# Altium schematic sheet Sheet1.SchDoc
size B; Organization: Altium Limited; Address1: L3, 12a Rodborough Rd; Address2: Frenchs Forest; Address3: NSW; Address4: Australia 2086
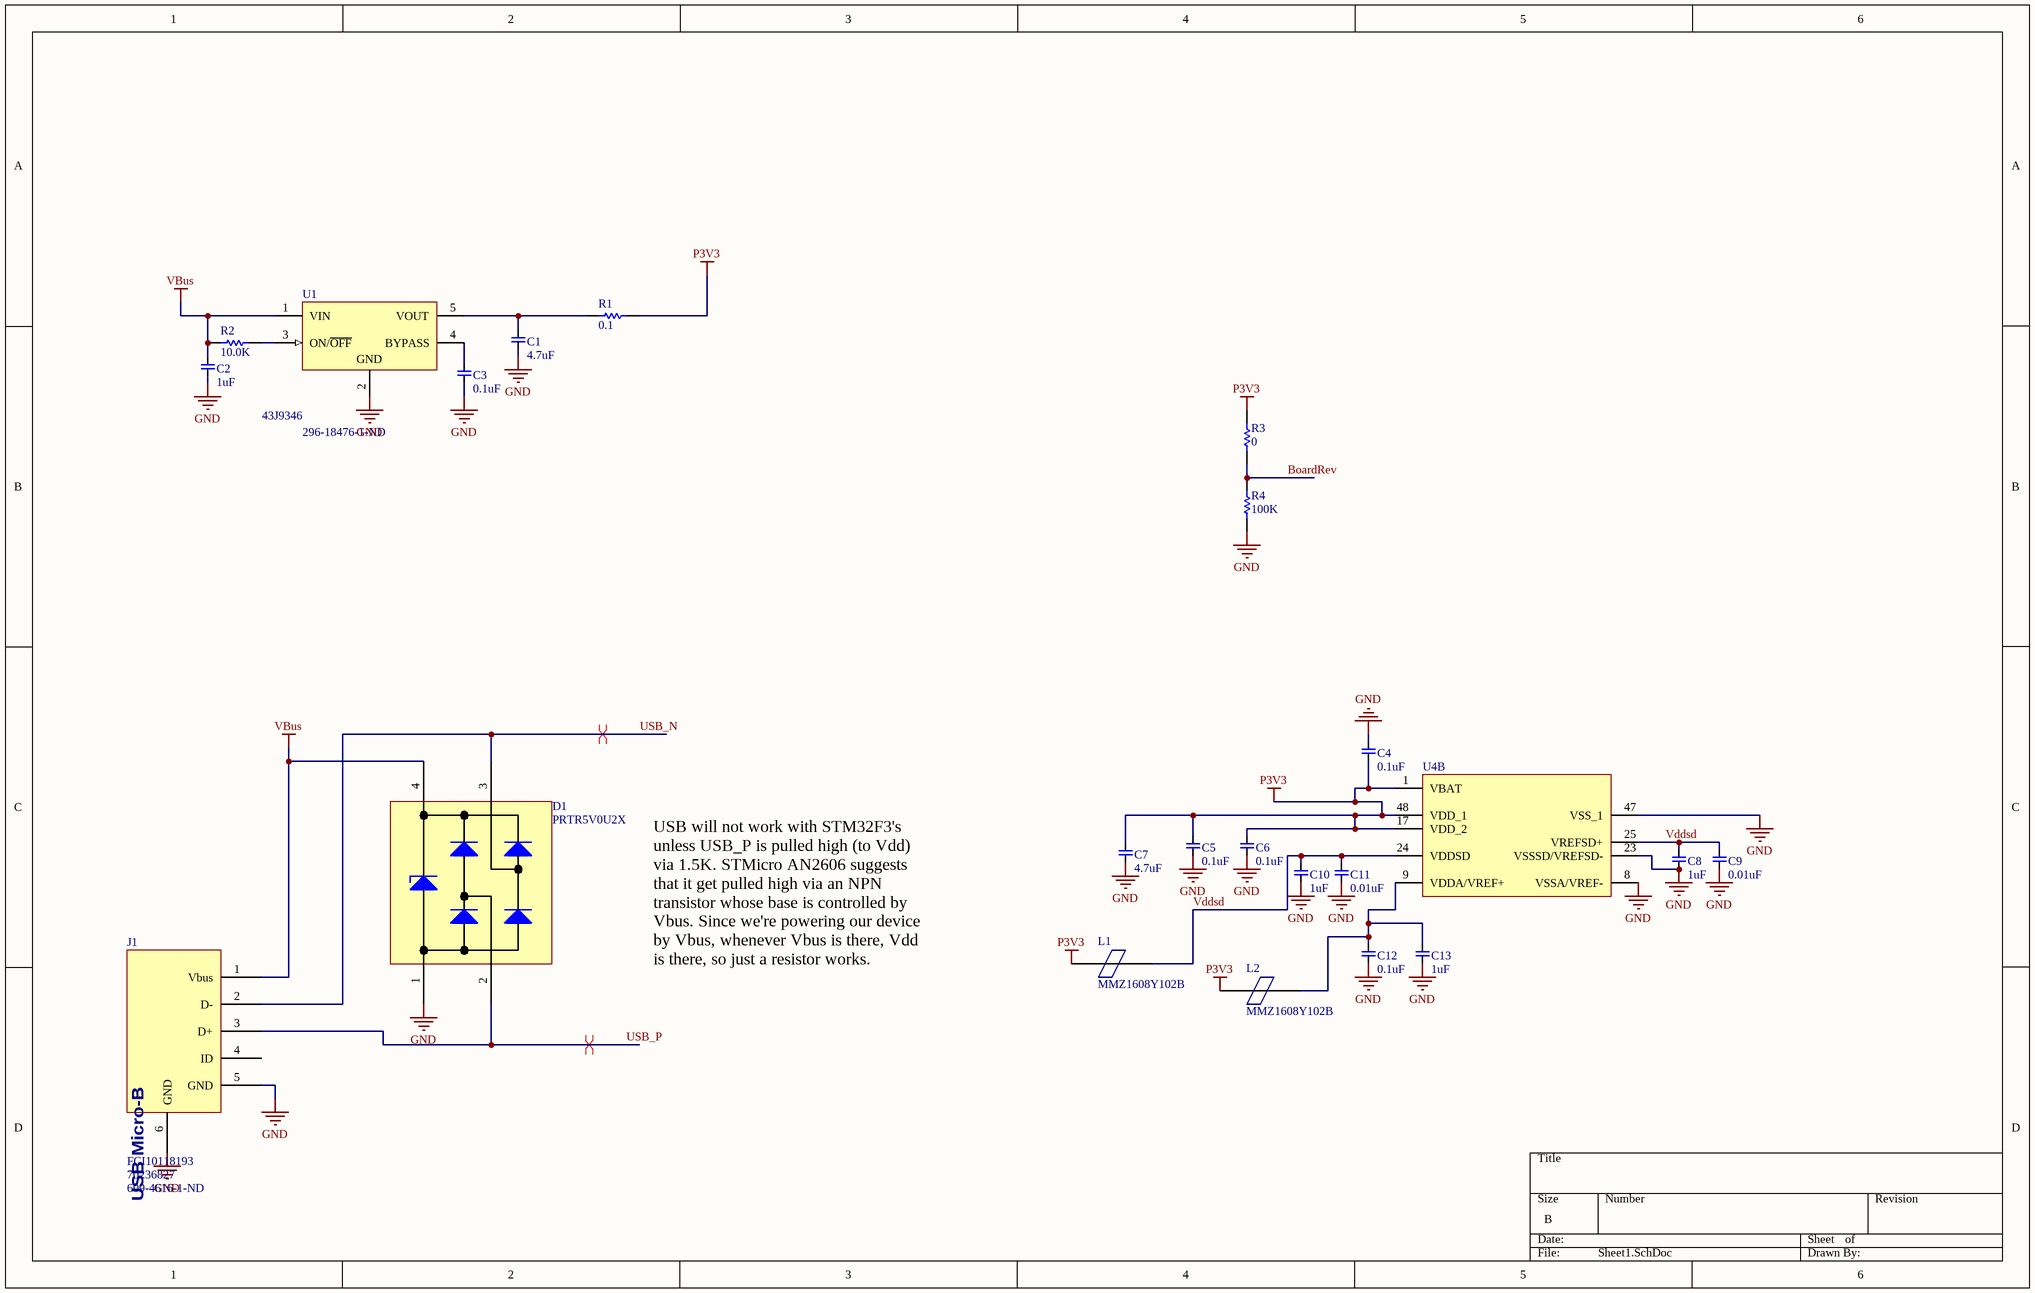
[diagram p0: Sheet1.SchDoc]

## Parts
C1  4.7uF  [CAP0603]
C2  1uF  [CAP0402]
C3  0.1uF  [CAP0402]
C4  0.1uF  [CAP0402]
C5  0.1uF  [CAP0402]
C6  0.1uF  [CAP0402]
C7  4.7uF  [CAP0603]
C8  1uF  [CAP0603]
C9  0.01uF  [CAP0402]
C10  1uF  [CAP0603]
C11  0.01uF  [CAP0402]
C12  0.1uF  [CAP0402]
C13  1uF  [CAP0603]
D1  PRTR5V0U2X  [SOT190P230X110-4N]
J1  FCI10118193  Supplier Part Number 1: 70236827  Supplier Part Number 2: 609-4616-1-ND  [FCI_10118193]
L1  MMZ1608Y102B  [INDC1608X06N]
L2  MMZ1608Y102B  [INDC1608X06N]
R1  0.1  [RES0402]
R2  10.0K  [RES0402]
R3  0  [RES0402]
R4  100K  [RES0402]
U1  Supplier Part Number 1: 43J9346  Supplier Part Number 2: 296-18476-1-ND  [TI-DBV5_N]
U4  (no value)  [STM-LQFP48_N]  (part B of 2)

## Nets
GND: C1.1 C2.1 C3.1 C4.2 C5.1 C6.1 C7.1 C8.1 C9.1 C10.1 C11.1 C12.1 C13.1 D1.1 J1.5(GND) J1.6(GND) R4.1 U1.2(GND) U4.8(VSSA/VREF-) U4.23(VSSSD/VREFSD-) U4.47(VSS_1)
P3V3: C4.1 C5.2 C6.2 C7.2 L1.1 L2.1 R1.2 R3.2 U4.1(VBAT) U4.17(VDD_2) U4.48(VDD_1)
VBus: C2.2 D1.4 J1.1(Vbus) R2.1 U1.1(VIN)
BoardRev: R3.1 R4.2
USB_N: D1.3 J1.2(D-)
USB_P: D1.2 J1.3(D+)
Vddsd: C8.2 C9.2 C10.2 C11.2 L1.2 U4.24(VDDSD) U4.25(VREFSD+)
NetC1_2: C1.2 R1.1 U1.5(VOUT)
NetC3_2: C3.2 U1.4(BYPASS)
NetC12_2: C12.2 C13.2 L2.2 U4.9(VDDA/VREF+)
NetR2_2: R2.2 U1.3(ON/~{OFF})

Not connected (* = marked no-connect by the designer): J1 4(ID)

## Layout directives
differential pair: USB_N, USB_P

## Notes on the sheet
- USB will not work with STM32F3's unless USB_P is pulled high (to Vdd) via 1.5K. STMicro AN2606 suggests that it get pulled high via an NPN transistor whose base is controlled by Vbus. Since we're powering our device by Vbus, whenever Vbus is there, Vdd is there, so just a resistor works.
- Title
- Size:
- Date:
- File:
- C
- Number:
- Time:
- Revision:
- Sheet
- of
- (in symbol CONN_USB_MICRO-B_HORIZ_TH) USB Micro-B

## Library data of the parts
C1 C7 = 878: CAP 4.7uF +/-10% 10V X6S 0603; Manufacturer: TDK; Manufacturer PN: C1608X6S1A475K; ID: 878; PkgCode: 0603; Value: 4.7uF; Tolerance: +/-10%; Voltage: 10V; Dielectric: X6S; ComponentLink1Description: Datasheet; ComponentLink1URL: http://www.tdk.com/pdf/general_B11.pdf; MaxComponentHeight: 0.9mm
C2 = 596: CAP 1uF +/-10% 10V X5R 0402; Manufacturer: TDK; Manufacturer PN: C1005X5R1A105K; ID: 596; PkgCode: 0402; Value: 1uF; Tolerance: +/-10%; Voltage: 10V; Dielectric: X5R; ComponentLink1Description: Datasheet; ComponentLink1URL: http://www.tdk.com/pdf/general_B11.pdf; MaxComponentHeight: 0.55mm
C3-C6 C12 = 485: CAP 0.1uF +/-10% 25V X7R 0402; Manufacturer: TDK; Manufacturer PN: C1005X7R1E104K; ID: 485; PkgCode: 0402; Value: 0.1uF; Tolerance: +/-10%; Voltage: 25V; Dielectric: X7R; ComponentLink1Description: Datasheet; ComponentLink1URL: http://www.tdk.com/pdf/general_B11.pdf; MaxComponentHeight: 0.55mm
C8 C10 C13 = 820: CAP 1uF +/-10% 25V X7R 0603; Manufacturer: TDK; Manufacturer PN: C1608X7R1E105K; ID: 820; PkgCode: 0603; Value: 1uF; Tolerance: +/-10%; Voltage: 25V; Dielectric: X7R; ComponentLink1Description: Datasheet; ComponentLink1URL: http://www.tdk.com/pdf/general_B11.pdf; MaxComponentHeight: 0.9mm
C9 C11 = 514: CAP 0.01uF +/-20% 50V X6S 0402; Manufacturer: TDK; Manufacturer PN: C1005X6S1H103M; ID: 514; PkgCode: 0402; Value: 0.01uF; Tolerance: +/-20%; Voltage: 50V; Dielectric: X6S; ComponentLink1Description: Datasheet; ComponentLink1URL: http://www.tdk.com/pdf/general_B11.pdf; MaxComponentHeight: 0.55mm
D1 = PRTR5V0U2X: Diode Array, ESD Protection 1pF USB2.0 SOT143; Manufacturer: NXP Semiconductors; ComponentLink1Description: Datasheet; ComponentLink1URL: http://www.nxp.com/documents/data_sheet/PRTR5V0U2X.pdf; Manufacturer PN: PRTR5V0U2X; Supplier 1: Digi-Key; Supplier Part Number 1: 568-4140-1-ND; Supplier 2: Mouser; Supplier Part Number 2: 771-PRTR5V0U2X-T/R; Supplier 3: Newark; Supplier Part Number 3: 75R4845
J1 = CONN_USB_MICRO-B_HORIZ_TH: Connector Receptacle USB - micro B 2.0 5 Position Surface Mount, Right Angle, Horizontal; Manufacturer: FCI; Manufacturer PN: 10118193-0001LF; Supplier 1: Allied; Supplier 2: Digi-Key
L1 L2 = MMZ1608Y102B: Ferrite, 1000oh, 400mA, 0603; ComponentLink1Description: Datasheet; ComponentLink1URL: http://www.tdk.co.jp/tefe02/e9412_mmz.pdf; Supplier 1: Newark; Supplier 2: Digi-Key; Supplier Part Number 1: 33P7606; Supplier Part Number 2: 445-1552-1-ND
R1 = 0402_0.1ohm: RES .1 OHM 1/6W 1% 0402 SMD; Manufacturer: Panasonic; Manufacturer PN: ERJ-2BSFR10X; Value: 0.1; Supplier 1: Arrow; Supplier Part Number 1: 41790361S8773345N1386; Supplier 2: Newark; Supplier Part Number 2: 53W4137; Supplier 3: Allied; Supplier Part Number 3: 70260854; Supplier 4: Digi-Key; Supplier Part Number 4: P.10AKCT-ND
R2 = 963: Resistor SMT 0402 10.0K 1% ohm; Manufacturer: Vishay; Manufacturer PN: CRCW040210K0FKED; ID: 963; Tempco: 100ppm/C; Power: 1/16W; PkgCode: 0402; Value: 10.0K; Tolerance: 1%; Supplier 1: Digi-Key; Supplier Part Number 1: 541-10.0KLCT-ND; ComponentLink1Description: Datasheet; ComponentLink1URL: http://www.vishay.com/docs/20035/dcrcwe3.pdf
R3 = 578: Resistor SMT 0402 0 1% ohm; Manufacturer: Vishay; Manufacturer PN: CRCW04020000Z0ED; ID: 578; Tempco: 100ppm/C; Power: 1/16W; PkgCode: 0402; Value: 0; Tolerance: 1%; Supplier 1: Digi-Key; Supplier Part Number 1: 541-0.0JCT-ND; ComponentLink1Description: Datasheet; ComponentLink1URL: http://www.vishay.com/docs/20035/dcrcwe3.pdf
R4 = 1059: Resistor SMT 0402 100K 1% ohm; Manufacturer: Vishay; Manufacturer PN: CRCW0402100KFKED; ID: 1059; Tempco: 100ppm/C; Power: 1/16W; PkgCode: 0402; Value: 100K; Tolerance: 1%; Supplier 1: Digi-Key; Supplier Part Number 1: 541-100KLCT-ND; ComponentLink1Description: Datasheet; ComponentLink1URL: http://www.vishay.com/docs/20035/dcrcwe3.pdf
U1 = LP2985-33DBVR: Single Output Low Noise LDO, 150 mA, Fixed 3.3 V Output, 2.2 to 16 V Input, with Low IQ, 5-pin SOT-23 (DBV), -40 to 125 degC, Green (RoHS & no Sb/Br); Manufacturer: Texas Instruments; Accuracy(%): 1.5; Fixed Output Options(V): 3.3; Iout(Max)(A): 0.15; Iq(Typ)(mA): 0.85; SubFamily: Single Channel LDO; Vdo(Typ)(mV): 280; Vin(Max)(V): 16; Vin(Min)(V): 2.2; Vout Adj(Max)(V): 10; DatasheetVersion: SLVS522N; PackageVersion: 4073253-4/K; PackageReference: DBV5; PackageDescription: 5-Pin Plastic Small Outline, Body 1.60 Ã— 2.90 mm, Pitch 0.95 mm; Eco-Plan: Green (RoHS & no Sb/Br); Vout Adj(Min)(V): 10; Mounting Technology: Surface Mount; Code_JEDEC: MO-178; PartNumber: LP2985-33DBVR; ComponentLink1Description: Manufacturer URL; ComponentLink1URL: http://www.ti.com/; ComponentLink2Description: Datasheet; ComponentLink2URL: http://www.ti.com/general/docs/lit/getliterature.tsp?genericPartNumber=LP2985-10&fileType=pdf; ComponentLink3Description: Package Specification; ComponentLink3URL: http://www.ti.com/litv/pdf/mpds018i; Supplier 1: Newark; Supplier 2: Digi-Key
U4 = STM32F373CCT6: ARM Cortex-M4 32-bit MCU, 256 KB Flash, 32 KB Internal RAM, 36 I/Os, 48-pin LQFP, -40 to 85 degC, Tray; FLASH Size (Prog) (kB): 256; I/Os (High Current): 36; Internal RAM Size (kB): 32; Operating Frequency(F) (Processor speed) (MHz): 72; Supply Voltage(Vcc) min (V): 2; DatasheetVersion: Rev. 3; PackageVersion: Rev. 6, 06/2013; PackageReference: LQFP48; PackageDescription: 48-Pin Low Profile Quad Flat Package, 7 x 7 mm Body, 0.5 mm Pitch; Supplier 1: Digi-Key; Supplier Part Number 1: 497-13251-ND; Supplier 2: Farnell; Supplier Part Number 2: 2215117; Supplier 3: Newark; Supplier Part Number 3: 46W2195; Supplier 4: Newark; Supplier Part Number 4: 48W6893; Supplier 5: Mouser; Supplier Part Number 5: 511-STM32F373CCT6; Core: ARM Cortex-M4; Packing: Tray; Mounting Technology: Surface Mount; PartNumber: STM32F373CCT6; ComponentLink1Description: Manufacturer URL; ComponentLink1URL: http://www.st.com/web/en/home.html; ComponentLink2Description: Datasheet; ComponentLink2URL: http://www.st.com/st-web-ui/static/active/en/resource/technical/document/datasheet/DM00046749.pdf; ComponentLink3Description: Package Specification; ComponentLink3URL: http://www.st.com/st-web-ui/static/active/en/resource/technical/document/datasheet/DM00058181.pdf